# EAGLE design NESverter-R1 (EAGLE 5.12)
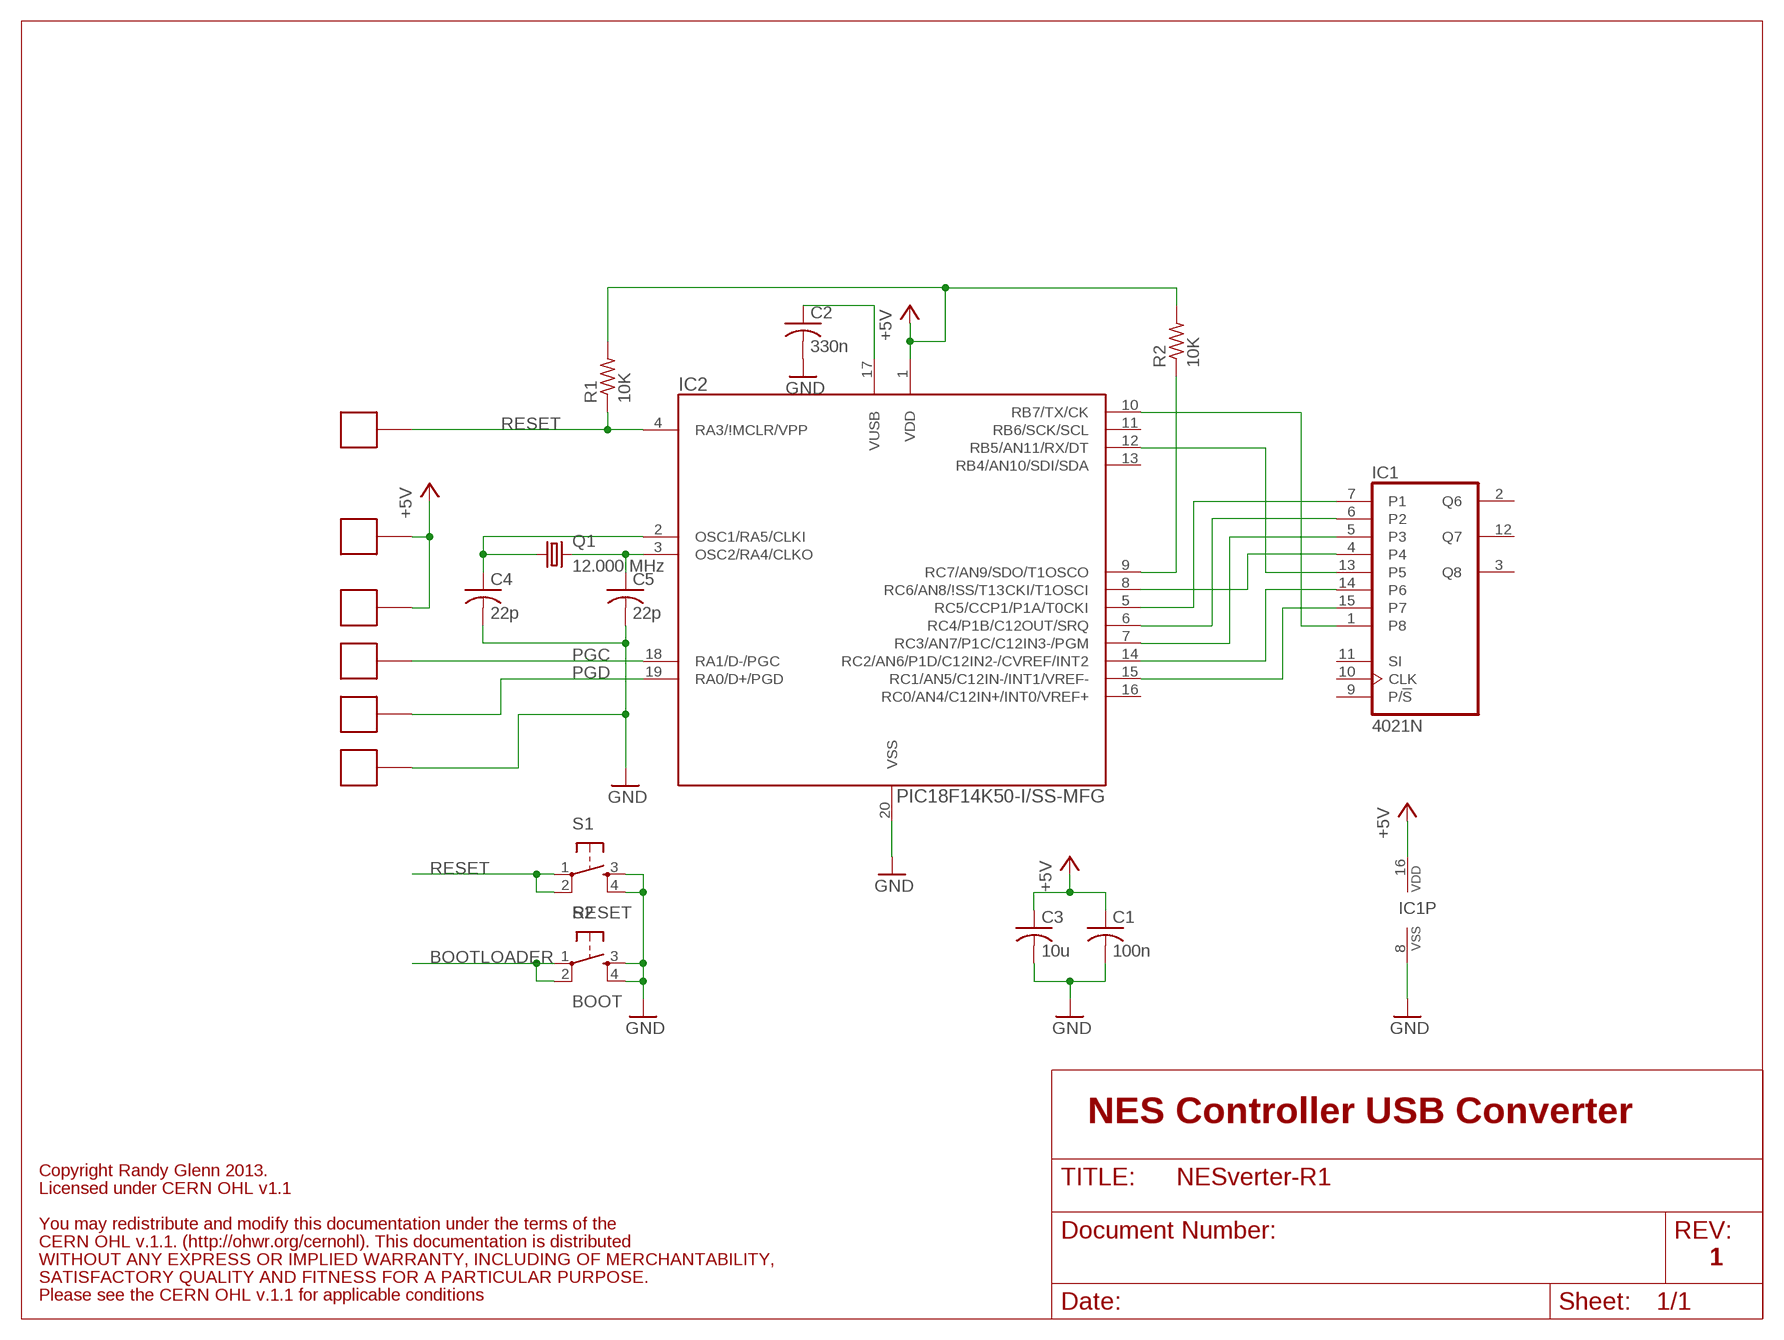
[diagram p0: schematic, sheet 1]

## Parts
C1  100n  C-USC0603  [C0603]
C2  330n  C-USC0603  [C0603]
C3  10u  C-USC0805  [C0805]
C4  22p  C-USC0603  [C0603]
C5  22p  C-USC0603  [C0603]
IC1  4021N  [DIL16]
IC2  PIC18F14K50-I/SS-MFG  [SSOP-20-MFG]
Q1  12.000 MHz  CRYSTALSM49  [SM49]
R1  10K  R-US_R0603  [R0603]
R2  10K  R-US_R0603  [R0603]
S1  RESET  TAC_SWITCHSMD  [TACTILE_SWITCH_SMD]
S2  BOOT  TAC_SWITCHSMD  [TACTILE_SWITCH_SMD]
X1  PAD-1.5X3  [PAD-1.5X3]
X2  PAD-2X4  [PAD-2X4]
X3  PAD-2X4  [PAD-2X4]
X4  PAD-2X4  [PAD-2X4]
X5  PAD-2X4  [PAD-2X4]
X6  PAD-1.5X3  [PAD-1.5X3]

## Nets
+5V: C1.1 C3.1 IC1.16(VDD) IC2.1(VDD) R1.2 R2.2 X1.P$1 X2.P$1
BOOTLOADER: IC2.9(RC7/AN9/SDO/T1OSCO) R2.1 S2.1 S2.2
GND: C1.2 C2.2 C3.2 C4.2 C5.2 IC1.8(VSS) IC2.20(VSS) S1.3 S1.4 S2.3 S2.4 X5.P$1
N$1: C4.1 IC2.2(OSC1/RA5/CLKI) Q1.1
N$2: C5.1 IC2.3(OSC2/RA4/CLKO) Q1.2
N$3: IC1.1(P8) IC2.10(RB7/TX/CK)
N$4: IC1.4 IC2.8(RC6/AN8/\!SS/T13CKI/T1OSCI)
N$5: C2.1 IC2.17(VUSB)
N$6: IC1.7(P1) IC2.5(RC5/CCP1/P1A/T0CKI)
N$7: IC1.6(P2) IC2.6(RC4/P1B/C12OUT/SRQ)
N$8: IC1.5(P3) IC2.7(RC3/AN7/P1C/C12IN3-/PGM)
N$9: IC1.13(P5) IC2.12(RB5/AN11/RX/DT)
N$10: IC1.14(P6) IC2.14(RC2/AN6/P1D/C12IN2-/CVREF/INT2)
N$11: IC1.15(P7) IC2.15(RC1/AN5/C12IN-/INT1/VREF-)
PGC: IC2.18(RA1/D-/PGC) X3.P$1
PGD: IC2.19(RA0/D+/PGD) X4.P$1
RESET: IC2.4(RA3/\!MCLR/VPP) R1.1 S1.1 S1.2 X6.P$1
Unconnected: IC1.2(Q6) IC1.3(Q8) IC1.9(P/!S) IC1.10(CLK) IC1.11(SI) IC1.12(Q7) IC2.11(RB6/SCK/SCL) IC2.13(RB4/AN10/SDI/SDA) IC2.16(RC0/AN4/C12IN+/INT0/VREF+)

## Notes on the sheet
- NES Controller USB Converter
- Copyright Randy Glenn 2013.
- Licensed under CERN OHL v1.1
- You may redistribute and modify this documentation under the terms of the
- CERN OHL v.1.1. (http://ohwr.org/cernohl). This documentation is distributed
- WITHOUT ANY EXPRESS OR IMPLIED WARRANTY, INCLUDING OF MERCHANTABILITY, | 1
- SATISFACTORY QUALITY AND FITNESS FOR A PARTICULAR PURPOSE.
- Please see the CERN OHL v.1.1 for applicable conditions

## Library data of the parts
C1-C5 = rcl:C-US: CAPACITOR, American symbol
IC1 = 40xx:4021: 8-bit static SHIFT REGISTER
IC2 = rbg-microchip-pic18:PIC18F14K50-I
Q1 = crystal:CRYSTAL: CRYSTAL; OC_FARNELL: unknown; OC_NEWARK: unknown
R1 R2 = rcl:R-US_: RESISTOR, American symbol
S1 S2 = SparkFun:TAC_SWITCH: Momentary Switch Button commonly used for reset or general input. Spark Fun Electronics SKU : COM-00097
X1-X6 = rbg-generic-pads:PAD

## Board
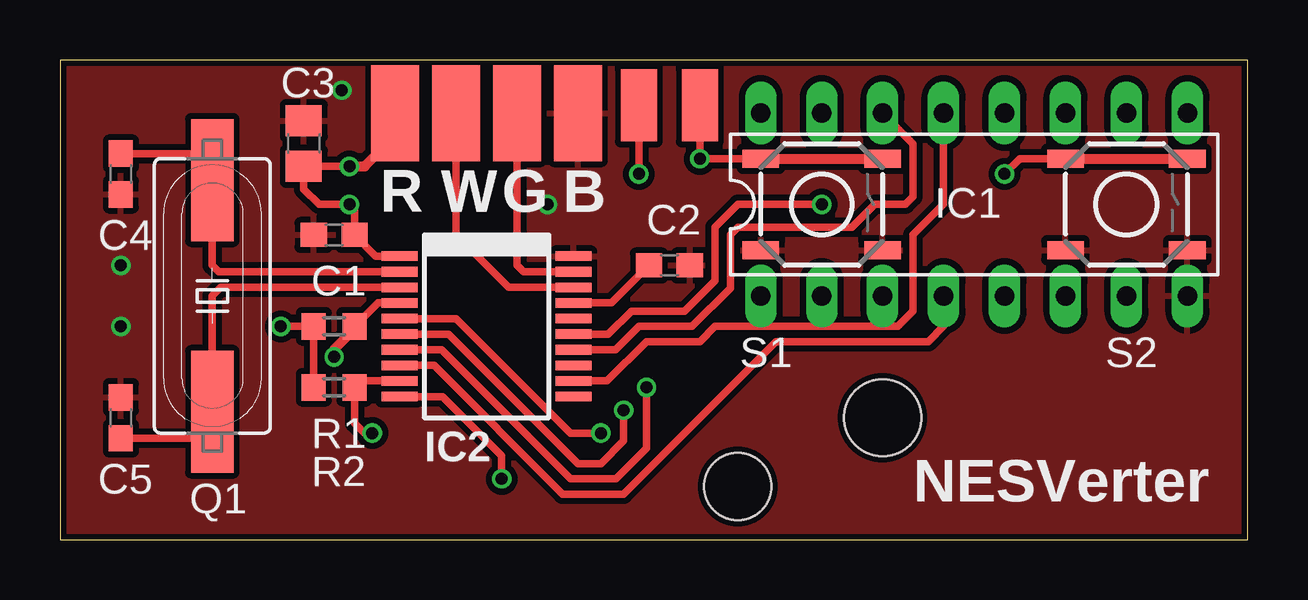
[diagram p1: board, top side]
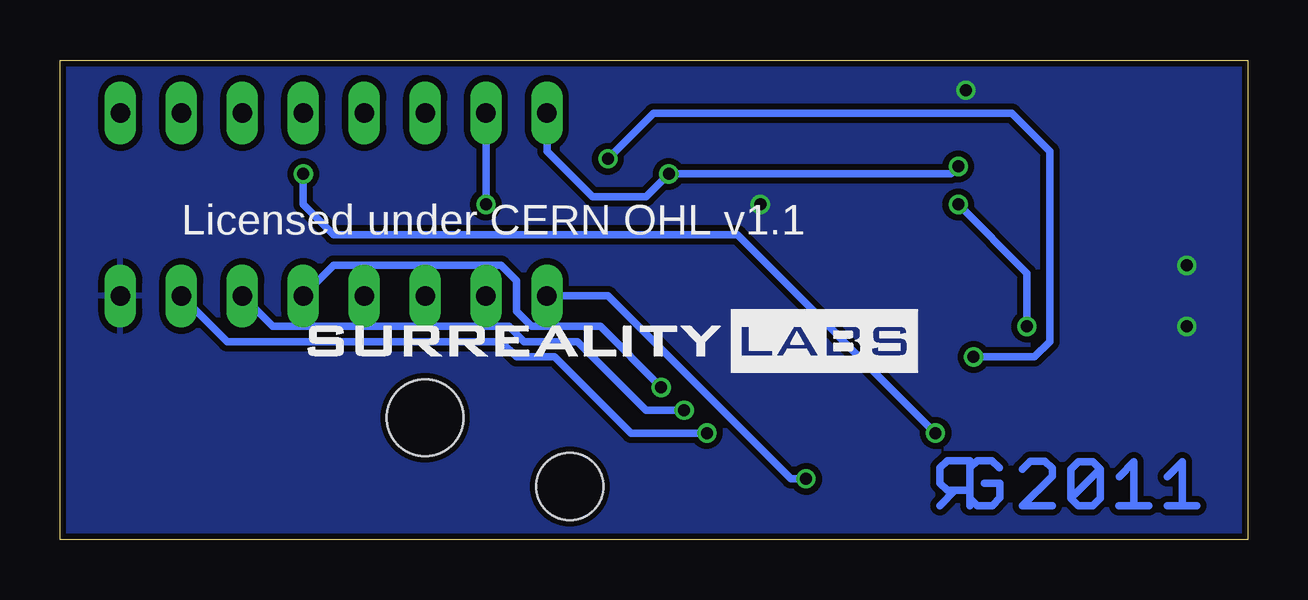
[diagram p2: board, bottom side, seen from below]

Size 49.51 x 19.99 mm. Coordinates in mm from the lower left corner, seen from the top.
Outline: 0,0 49.51,0 49.51,19.99 0,19.99 0,0
Copper layers (1*16): Top 0.035mm / dielectric 1.5mm / Bottom 0.035mm
Design rules "Fusion_eagle_rule_v1.1 *": minimum track width 6mil, minimum drill 12mil, track to track 6mil, track to pad 6mil, pad to pad 6mil, via to via 6mil, smd to smd 0mil, copper to edge 10mil, drill to drill 10mil, minimum pad ring 10mil, minimum via ring 6mil, stop-mask expansion 2mil, vias tented up to drill 100mil, thermal gap 10mil
Holes 3.2 mm at 34.29,5.08
Holes 2.8 mm at 28.26,2.22

### Footprints (pad centres in the part's own frame; a part is rotated, then mirrored left to right if it is on the bottom)
C0603 = smd 1.1 x 1: 1 -0.85,0; 2 0.85,0
C0805 = smd 1.3 x 1.5: 1 -0.95,0; 2 0.95,0
DIL16 = drill 0.813 long: 1 -8.89,-3.81; 2 -6.35,-3.81; 3 -3.81,-3.81; 4 -1.27,-3.81; 5 1.27,-3.81; 6 3.81,-3.81; 7 6.35,-3.81; 8 8.89,-3.81; 9 8.89,3.81; 10 6.35,3.81; 11 3.81,3.81; 12 1.27,3.81; 13 -1.27,3.81; 14 -3.81,3.81; 15 -6.35,3.81; 16 -8.89,3.81
SSOP-20-MFG = smd 0.4 x 1.5: 1 -2.925,-3.625; 2 -2.275,-3.625; 3 -1.625,-3.625; 4 -0.975,-3.625; 5 -0.325,-3.625; 6 0.325,-3.625; 7 0.975,-3.625; 8 1.625,-3.625; 9 2.275,-3.625; 10 2.925,-3.625; 11 2.925,3.625; 12 2.275,3.625; 13 1.625,3.625; 14 0.975,3.625; 15 0.325,3.625; 16 -0.325,3.625; 17 -0.975,3.625; 18 -1.625,3.625; 19 -2.275,3.625; 20 -2.925,3.625
SM49 = smd 5.08 x 1.778: 1 -4.826,0; 2 4.826,0
R0603 = smd 1 x 1.1: 1 -0.85,0; 2 0.85,0
TACTILE_SWITCH_SMD = smd 1.524 x 0.762: 1 -2.54,1.905; 2 2.54,1.905; 3 -2.54,-1.905; 4 2.54,-1.905
PAD-1.5X3 = smd 3 x 1.5: P$1 0,0
PAD-2X4 = smd 4 x 2: P$1 0,0

### Placement (x,y rotation side)
C1  11.43,12.7 180 top
C2  25.4,11.43 0 top
C3  10.16,16.51 90 top
C4  2.54,15.24 270 top
C5  2.54,5.08 90 top
IC1  38.1,13.97 0 top
IC2  17.78,8.89 270 top
Q1  6.35,10.16 270 top
R1  11.43,8.89 180 top
R2  11.43,6.35 180 top
S1  31.75,13.97 0 top
S2  44.45,13.97 0 top
U$1  [RGLOGO_SMALL_2011]  11.43,1.27 0 bottom
U$2  [SURREALITY_LOGO_SILK]  39.37,6.99 0 bottom
X1  24.13,18.1 90 top
X2  13.97,17.78 90 top
X3  16.51,17.78 90 top
X4  19.05,17.78 90 top
X5  21.59,17.78 90 top
X6  26.67,18.1 270 top

### Tracks (layer width: path | path; a pad name or v marks a point on that pad's centre or on a via)
+5V  (via drill 0.5)
  Top 0.305: R2.2 R1.2 v9.21,8.89 | IC2.1 13.16,11.81 C1.1 12.28,13.76 v12.06,13.97 10.79,13.97 10.16,14.61 C3.1 v12.07,15.56 v12.06,15.56 | v24.13,15.24 X1.P$1
  Top 0.406: X2.P$1 13.97,16.83 12.7,15.56 v12.07,15.56
  Bottom 0.305: v12.06,15.56 12.38,15.24 v24.13,15.24 25.08,14.29 27.3,14.29 29.21,16.19 IC1.16 | v9.21,8.89 9.21,11.11 v12.06,13.97
BOOTLOADER  (via drill 0.5)
  Top 0.305: IC2.9 12.54,6.62 R2.1 12.28,4.87 12.7,4.45 v13.02,4.45 | S2.1 40.01,15.88 v39.37,15.24
  Top 0.406: S2.1 S2.2
  Bottom 0.305: v39.37,15.24 39.37,13.97 38.1,12.7 21.27,12.7 v13.02,4.45
GND  (via drill 0.5)
  other vias: 2.54,11.43 2.54,8.89 11.75,18.73 20.32,13.97
  pour Top (isolate 0.254): -0.32,20.32 49.85,20.32 49.85,-0.32 -0.32,-0.32
  pour Bottom (isolate 0.254): -0.32,20.32 49.85,20.32 49.85,-0.32 -0.32,-0.32
N$1
  Top 0.305: IC2.2 6.62,11.16 6.35,11.43 Q1.1 6.35,15.24 5.5,16.09 C4.1
N$2
  Top 0.305: IC2.3 6.71,10.52 6.35,10.16 Q1.2 6.35,5.08 5.5,4.23 C5.1
N$3  (via drill 0.5)
  Top 0.305: IC2.10 15.94,5.96 18.41,3.49 v18.41,2.54
  Bottom 0.305: v18.41,2.54 19.05,2.54 26.67,10.16 IC1.1
N$4
  Top 0.305: IC2.8 15.6,7.26 20.95,1.91 23.5,1.91 29.84,8.26 36.2,8.26 36.83,8.89 IC1.4
N$5
  Top 0.305: IC2.17 22.98,9.87 C2.1
N$6  (via drill 0.5)
  Top 0.305: IC2.5 16.5,9.21 21.27,4.45 v22.54,4.45
  Bottom 0.305: v22.54,4.45 25.72,4.45 28.89,7.62 30.48,7.62 31.11,8.26 42.55,8.26 IC1.7
N$7  (via drill 0.5)
  Top 0.305: IC2.6 16.2,8.56 21.59,3.17 22.54,3.17 23.5,4.13 v23.5,5.4
  Bottom 0.305: v23.5,5.4 25.08,5.4 27.94,8.26 30.16,8.26 30.8,8.89 40.64,8.89 IC1.6
N$8  (via drill 0.5)
  Top 0.305: IC2.7 15.9,7.92 21.27,2.54 23.18,2.54 24.45,3.81 v24.45,6.35
  Bottom 0.305: v24.45,6.35 26.99,8.89 29.84,8.89 30.48,9.53 30.48,10.79 31.11,11.43 38.1,11.43 IC1.5
N$9
  Top 0.305: IC1.13 36.83,13.97 35.56,12.7 35.56,9.53 34.92,8.89 27.3,8.89 26.67,8.26 24.45,8.26 22.81,6.62 IC2.12
N$10
  Top 0.305: IC2.14 23.16,7.92 24.13,8.89 26.35,8.89 27.94,10.48 27.94,12.7 28.26,13.02 33.02,13.02 33.97,13.97 35.24,13.97 35.56,14.29 35.56,16.51 IC1.14
N$11  (via drill 0.5)
  Top 0.305: IC2.15 22.85,8.56 23.81,9.53 26.04,9.53 27.3,10.79 27.3,13.02 28.26,13.97 v31.75,13.97
  Bottom 0.305: v31.75,13.97 IC1.15
PGC
  Top 0.305: IC2.18 18.7,10.52 16.51,12.7 X3.P$1
PGD
  Top 0.305: IC2.19 19.32,11.16 19.05,11.43 X4.P$1
RESET  (via drill 0.5)
  Top 0.305: IC2.4 13.26,9.87 R1.1 | S1.1 v26.67,15.88 X6.P$1
  Top 0.406: R1.1 12.28,8.79 11.43,7.94 v11.43,7.62 | S1.1 S1.2 | X6.P$1 26.67,17.14
  Bottom 0.305: v11.43,7.62 8.89,7.62 8.26,8.26 8.26,16.19 9.84,17.78 24.77,17.78 v26.67,15.88

### Text on the board
tPlace: R | W | G | B
tNames: NESVerter
bNames: Licensed under CERN OHL v1.1